# Altium schematic sheet STLink.SchDoc
size A; SheetNumber: 7; SheetTotal: 10
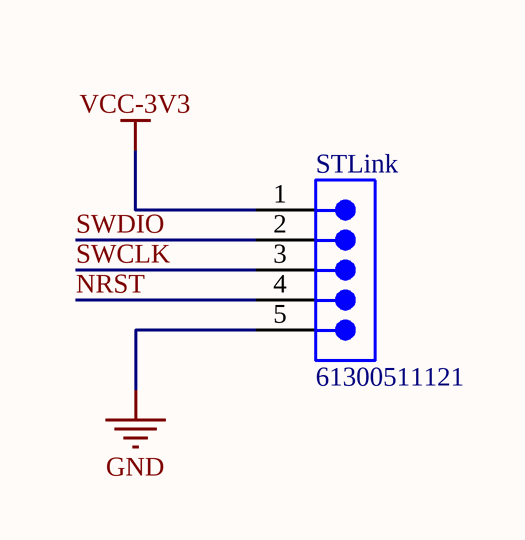
[diagram p0: STLink.SchDoc]

## Parts
STLink  61300511121  [61300511121]

## Nets
GND: STLink.5
VCC-3V3: STLink.1
NRST: STLink.4
SWCLK: STLink.3
SWDIO: STLink.2

## Library data of the parts
STLink = CMP-1502-01068-4: THT Vertical Pin Header WR-PHD, Pitch 2.54 mm, Single Row, 5 pins; Number of Contacts: 5; Connector Type: Male Pin; Operating Supply Voltage: 250V; Contact Resistance: 20mΩ; Gender: Male; Pitch: 2.54mm; Current Rating: 3A; Min Operating Temperature: -40°C; Contact Material: Gold; Color: Black; RoHS: Compliant; Number of Rows: 1; Lead Free: Lead Free; Height: 8.89mm; Contact Plating: Gold; Number of Pins: 5; Orientation: Vertical; Voltage Rating: 250V; Packaging: Bulk; Number of Positions: 5; Max Operating Temperature: 105°C; Termination: Solder; Lead Pitch: 2.54mm; Contact Mating Length: 5.9944mm; Mount: Through Hole